# EasyEDA Pro project 包裹款-触摸屏控制板-V1.3(1).epro, board PCB2
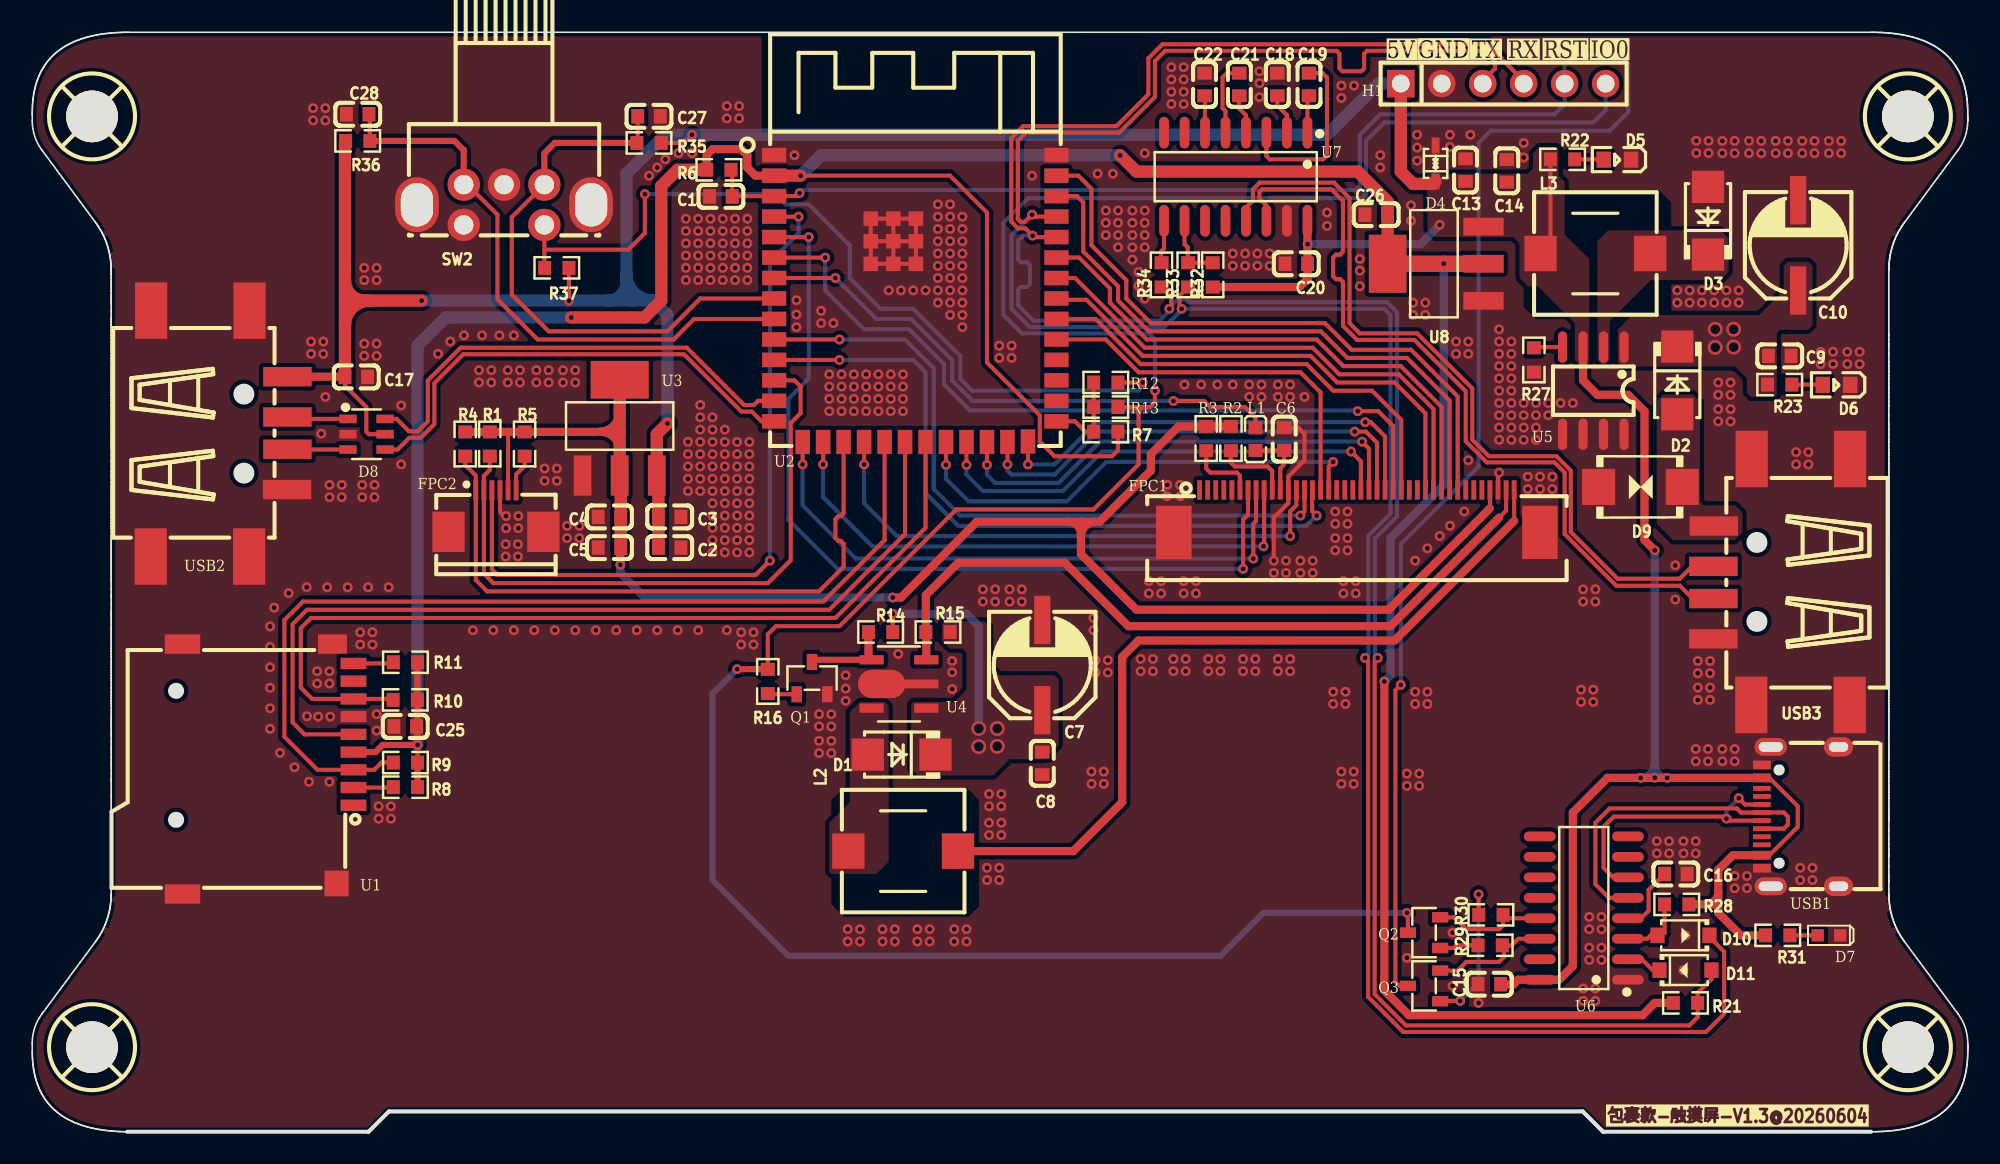
[diagram p1: board, top side]
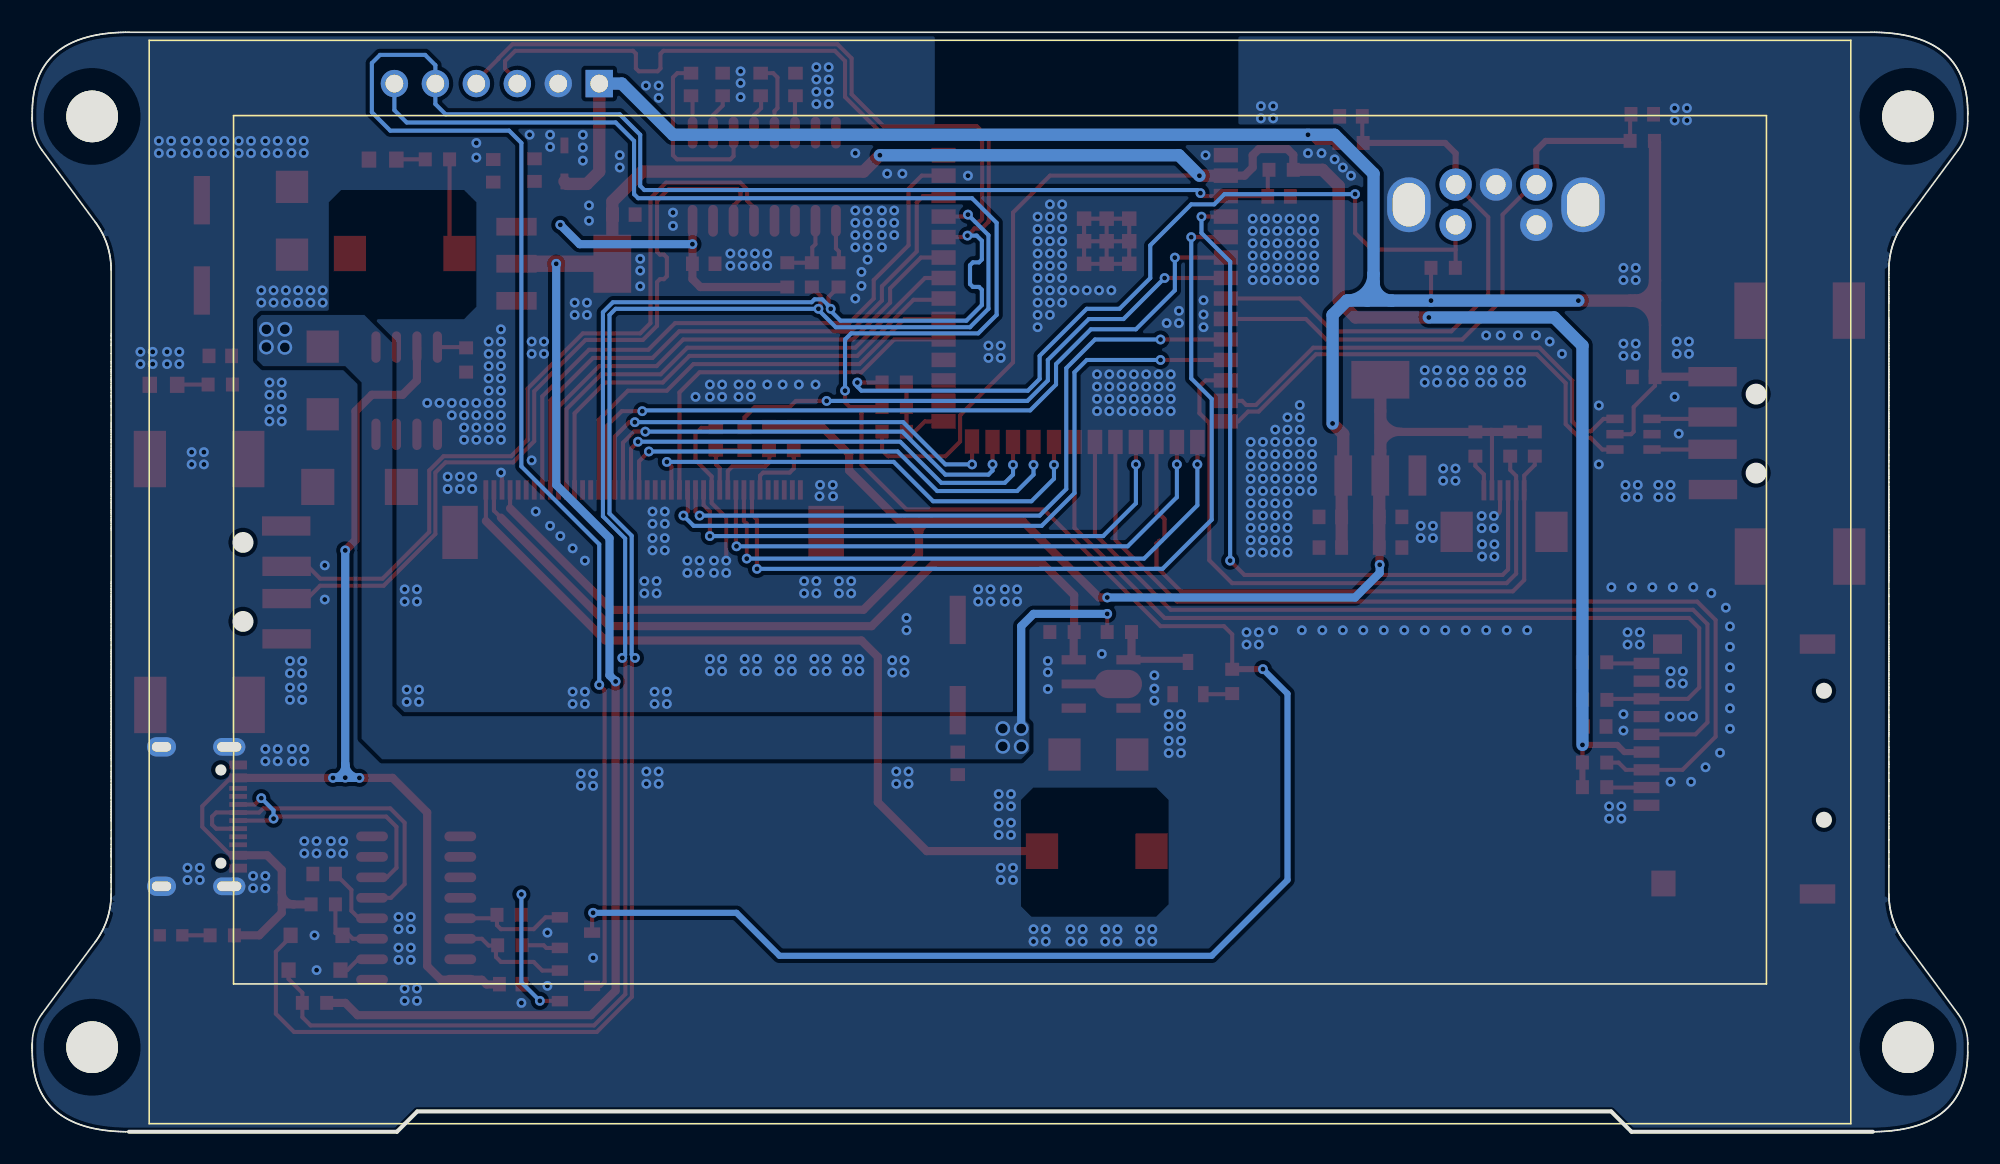
[diagram p2: board, bottom side, seen from below]

Outline 120 x 68.2 mm; copper layers: Top Layer, Bottom Layer. Coordinates in mm from the lower left corner of the outline.
Stack: Top Layer 0.035mm / Dielectric1 1.51mm FR4 er 4.5 / Bottom Layer 0.035mm

## Design rules (mm)
spacing copperThickness1oz (default): track to track 0.102, other pairs 0.152 to 0.3
spacing copperThickness2oz: track to track 0.203, other pairs 0.152 to 0.3
track width copperThickness1oz (default): min 0.127, default 0.254, max 2.54
track width copperThickness2oz: min 0.203, default 0.254, max 2.54
differential pair differentialPair (default): width min 0.127, default 0.254, max 2.54; gap min 0.152, default 0.152
net GND uses 无发散间距

## Placement (name value [footprint] x y rotation side)
C1  100nF  [C0603]  42.7 58.02 0 top
C2  1uF  [C0603]  39.52 36.23 180 top
C3  100nF  [C0603]  39.52 38.14 180 top
C4  1uF  [C0603]  35.79 38.14 0 top
C5  100nF  [C0603]  35.79 36.23 0 top
C6  100nF  [C0603]  77.62 42.96 270 top
C7  100uF  [电解电容贴片6X6]  62.62 28.95 90 top
C8  100nF  [C0603]  62.62 22.85 270 top
C9  100nF  [C0603]  108.34 48.12 180 top
C10  100uF  [电解电容贴片6X6]  109.49 54.98 90 top
C13  100nF  [C0603]  88.86 59.65 90 top
C14  10uF  [C0603]  91.42 59.6 270 top
C15  100nF  [C0603]  90.34 9.15 180 top
C16  100nF  [C0603]  101.9 15.99 0 top
C17  100nF  [C0603]  20.09 46.82 0 top
C18  100nF  [C0603]  77.19 64.96 270 top
C19  100nF  [C0603]  79.16 64.96 270 top
C20  100nF  [C0603]  78.37 53.84 0 top
C21  100nF  [C0603]  74.84 64.96 270 top
C22  100nF  [C0603]  72.68 64.96 90 top
C25  1uF  [C0603]  23.12 25.14 0 top
C26  100nF  [C0603]  83.32 56.89 0 top
C27  10nF  [C0603]  38.24 62.98 0 top
C28  10nF  [C0603]  20.18 63.11 180 top
D1  SS56  [SMA]  53.9 23.4 180 top
D2  SS56  [SMA]  101.99 46.6 270 top
D3  SS56  [SMA]  103.9 56.51 90 top
D4  PESD5V0L1BA-N  [SOD-323_L1.8-W1.3-LS2.5-BI]  87.01 60.06 270 top
D5  绿光  [0603LED]  98.31 60.32 0 top
D6  绿光  [0603LED]  111.9 46.35 0 top
D7  LED红  [0603L]  111.39 12.18 0 top
D8  USBLC6-2SC6  [SOT-23-6_L2.9-W1.6-P0.95-LS2.8-BL]  20.72 43.27 270 top
D9  SMBJ28CA  [SMB_L4.3-W3.6-LS5.4-BI]  99.71 40 180 top
D10  1N4148W  [SOD-123_L2.7-W1.6-LS3.7-FD]  102.37 12.18 0 top
D11  1N4148W  [SOD-123_L2.7-W1.6-LS3.7-FD]  102.5 10.03 180 top
FPC1  AFC07-S40ECA-00  [FPC-SMD_P0.50-40P_LCS-SJ-H2.0]  82.13 38.49 180 top
FPC2  FPC-05F-6PH20(0.5)  [FPC-SMD_6P-P0.50_XUNPU_FPC-05F-6PH20]  28.75 38.5 0 top
H1  PZ254V-11-06P  [HDR-TH_6P-P2.54-V-M]  91.2 65.02 0 top
L1  10uH  [L0603]  75.84 42.96 90 top
L2  68uH  [IND-SMD_L7.0-W7.0_SMDRI74-330MT]  54 17.41 0 top
L3  68uH  [IND-SMD_L7.0-W7.0_SMDRI74-330MT]  96.91 54.47 0 top
Q1  SS8050  [SOT-23-3_L2.9-W1.3-P1.90-LS2.4-BR]  48.35 28.14 270 top
Q2  SS8050  [SOT-23-3_L2.9-W1.3-P1.90-LS2.4-BR]  86.29 12.35 0 top
Q3  SS8050  [SOT-23-3_L2.9-W1.3-P1.90-LS2.4-BR]  86.29 9.05 0 top
R1  10kΩ  [R0603]  28.37 42.66 270 top
R2  10kΩ  [R0603]  74.32 43 270 top
R3  10kΩ  [R0603]  72.78 43 270 top
R4  10kΩ  [R0603]  26.84 42.66 270 top
R5  10kΩ  [R0603]  30.53 42.66 270 top
R6  10kΩ  [R0603]  42.57 59.67 0 top
R7  10kΩ  [R0603]  66.56 43.43 180 top
R8  10kΩ  [R0603]  23.14 21.37 0 top
R9  10kΩ  [R0603]  23.14 22.9 0 top
R10  10kΩ  [R0603]  23.12 26.79 0 top
R11  10kΩ  [R0603]  23.14 29.12 0 top
R12  0/NC  [R0603]  66.56 46.47 180 top
R13  0/NC  [R0603]  66.56 44.95 180 top
R14  51kΩ  [R0603]  52.6 31 180 top
R15  1kΩ  [R0603]  56.16 31 180 top
R16  1kΩ  [R0603]  45.6 27.93 90 top
R21  10kΩ  [R0603]  102.5 7.99 180 top
R22  10kΩ  [R0603]  94.88 60.32 180 top
R23  47kΩ  [R0603]  108.34 46.35 180 top
R27  10kΩ  [R0603]  93.1 47.87 270 top
R28  10kΩ  [R0603]  101.96 14.1 180 top
R29  10kΩ  [R0603]  90.39 11.57 0 top
R30  10kΩ  [R0603]  90.44 13.45 0 top
R31  10kΩ  [R0603]  108.22 12.18 0 top
R32  10kΩ  [R0603]  73.19 53.15 90 top
R33  100Ω  [R0603]  71.66 53.15 90 top
R34  100Ω  [R0603]  70.01 53.15 90 top
R35  10kΩ  [R0603]  38.24 61.33 180 top
R36  10kΩ  [R0603]  20.18 61.46 0 top
R37  10kΩ  [R0603]  32.52 53.59 180 top
SCREW1  -  [M3螺丝]  116.29 62.98 0 top
SCREW2  -  [M3螺丝]  3.71 62.98 0 top
SCREW3  -  [M3螺丝]  3.71 5.25 0 top
SCREW4  -  [M3螺丝]  116.29 5.25 0 top
SW2  EC11B15242AZ  [SW-TH_EC11B1524XX]  29.25 57.5 90 top
U1  自弹TF卡座TFAA  [SIM-SMD_C9900015645]  14.62 22.5 270 top
U2  ESPS3-32-WROOM-1-N16R8  [WIRELM-SMD_ESP32-S3-WROOM-2-N32R8V]  54.75 51.68 0 top
U3  AMS1117-3.3  [SOT-223-3_L6.5-W3.4-P2.30-LS7.0-BR]  36.42 43.67 270 top
U4  PT4115  [SOT-89-5_L4.5-W2.5-P1.50-LS4.5-BR]  53.73 27.78 0 top
U5  XL1509-5.0E1  [SOIC-8_L5.0-W4.0-P1.27-LS6.0-BL]  96.78 45.97 180 top
U6  CH340C  [SOIC-16_L9.9-W3.9-P1.27-LS6.0-BL]  96.2 13.88 90 top
U7  SP3232EEN-L/TR  [SOIC-16_L9.9-W3.9-P1.27-LS6.0-BL]  74.62 59.24 180 top
U8  AMS1117-3.3  [SOT-223-3_L6.5-W3.4-P2.30-LS7.0-BR]  87.01 53.84 0 top
USB1  TYPE-C 16PIN 2MD(073)  [USB-C-SMD_TYPE-C-16PIN-2MD-073]  109.61 19.55 90 top
USB2  AF 10.0 QT-ZB6.8  [USB-A-SMD_AF-10.0-QT-ZB6.8]  11.58 43.31 270 top
USB3  AF 10.0 QT-ZB6.8  [USB-A-SMD_AF-10.0-QT-ZB6.8]  108.47 34.1 90 top

## Footprints (pads in the part's own frame, mm; a bottom-side part is the same pattern mirrored in y, then rotated)
0603L
  rect 0.762x0.762 smd: 1(-0.699,0) 2(0.699,0)
0603LED
  rect 0.9x1 smd: 1(-0.884,-0.017) 2(0.816,-0.017)
C0603
  rect 0.8x0.9 smd: 1(-0.7,0) 2(0.7,0)
FPC-SMD_6P-P0.50_XUNPU_FPC-05F-6PH20
  rect 0.3x1.25 smd: 1(-1.25,1.288) 2(-0.75,1.288) 3(-0.25,1.288) 4(0.25,1.288) 5(0.75,1.288) 6(1.25,1.288)
  rect 2x2.5 smd: 7(2.94,-1.288) 8(-2.94,-1.288)
FPC-SMD_P0.50-40P_LCS-SJ-H2.0
  rect 0.3x1.2 smd: 1(9.751,-1.318) 2(9.252,-1.318) 3(8.753,-1.318) 4(8.252,-1.318) 5(7.752,-1.318) 6(7.252,-1.318) 7(6.752,-1.318) 8(6.251,-1.318) 9(5.753,-1.318) 10(5.253,-1.318) 11(4.753,-1.318) 12(4.252,-1.318) 13(3.752,-1.318) 14(3.251,-1.318) 15(2.752,-1.318) 16(2.253,-1.318) 17(1.752,-1.318) 18(1.252,-1.318) 19(0.752,-1.318) 20(0.252,-1.318) 21(-0.249,-1.318) 22(-0.748,-1.318) 23(-1.247,-1.318) 24(-1.748,-1.318) 25(-2.248,-1.318) 26(-2.748,-1.318) 27(-3.248,-1.318) 28(-3.749,-1.318) 29(-4.247,-1.318) 30(-4.747,-1.318) 31(-5.247,-1.318) 32(-5.748,-1.318) 33(-6.248,-1.318) 34(-6.749,-1.318) 35(-7.248,-1.318) 36(-7.747,-1.318) 37(-8.248,-1.318) 38(-8.748,-1.318) 39(-9.248,-1.318) 40(-9.748,-1.318)
  rect 2.2x3.3 smd: 41(11.35,1.318) 42(-11.35,1.318)
HDR-TH_6P-P2.54-V-M
  rect 1.7x1.7 hole 1.1: 1(-6.35,0)
  round 1.7 hole 1.1: 2(-3.81,0) 3(-1.27,0) 4(1.27,0) 5(3.81,0) 6(6.35,0)
IND-SMD_L7.0-W7.0_SMDRI74-330MT
  rect 2x2.2 smd: 1(-3.4,0) 2(3.4,0)
L0603
  rect 0.8x0.864 smd: 1(-0.7,0) 2(0.7,0)
M3螺丝
  round 3.2 hole 3.2: 1(0,0)
R0603
  rect 0.806x0.864 smd: 1(-0.753,0) 2(0.753,0)
SIM-SMD_C9900015645
  rect 0.7x1.6 smd: 1(2.25,5.3) 2(1.15,5.3) 3(0.05,5.3) 4(-1.05,5.3) 5(-2.15,5.3) 6(-3.25,5.3) 7(-4.35,5.3) 8(-5.45,5.3) 9(-6.55,5.3)
  rect 1.2x1.8 smd: 10(-7.75,4)
  rect 1.6x1.5 smd: 11(7.1,4.25)
  rect 1.2x2.2 smd: 12(-7.75,-5.3) 13(7.75,-5.3)
SMA
  rect 2x2 smd: 1(2.1,0) 2(-2.1,0)
SMB_L4.3-W3.6-LS5.4-BI
  rect 2.047x2.241 smd: 1(-2.591,0) 2(2.591,0)
SOD-123_L2.7-W1.6-LS3.7-FD
  rect 0.88x0.96 smd: 1(-1.61,0) 2(1.61,0)
SOD-323_L1.8-W1.3-LS2.5-BI
  rect 0.985x0.49 smd: 1(-1.117,0) 2(1.117,0)
SOIC-8_L5.0-W4.0-P1.27-LS6.0-BL
  oval 0.569x1.95 smd: 1(-1.905,-2.705) 2(-0.635,-2.705) 3(0.635,-2.705) 4(1.905,-2.705) 5(1.905,2.705) 6(0.635,2.705) 7(-0.635,2.705) 8(-1.905,2.705)
SOIC-16_L9.9-W3.9-P1.27-LS6.0-BL
  oval 0.602x1.971 smd: 1(-4.445,-2.736) 2(-3.175,-2.736) 3(-1.905,-2.736) 4(-0.635,-2.736) 5(0.635,-2.736) 6(1.905,-2.736) 7(3.175,-2.736) 8(4.445,-2.736) 9(4.445,2.736) 10(3.175,2.736) 11(1.905,2.736) 12(0.635,2.736) 13(-0.635,2.736) 14(-1.905,2.736) 15(-3.175,2.736) 16(-4.445,2.736)
SOT-23-3_L2.9-W1.3-P1.90-LS2.4-BR
  rect 1x0.65 smd: 1(1,-0.95) 2(1,0.95) 3(-1,0)
SOT-23-6_L2.9-W1.6-P0.95-LS2.8-BL
  rect 0.532x1.072 smd: 1(-0.95,-1.149) 2(0,-1.149) 3(0.95,-1.149) 4(0.95,1.149) 5(0,1.149) 6(-0.95,1.149)
SOT-89-5_L4.5-W2.5-P1.50-LS4.5-BR
  rect 1.5x0.574 smd: 1(1.698,-1.5) 3(1.698,1.5) 4(-1.698,1.5) 5(-1.698,-1.5)
  oval 2.94x1.76 smd: 2(-1.067,0)
  rect 2.209x0.552 smd: 2(1.343,0)
SOT-223-3_L6.5-W3.4-P2.30-LS7.0-BR
  rect 2.5x1.1 smd: 1(2.97,-2.3) 2(2.97,0) 3(2.97,2.3)
  rect 2.34x3.6 smd: 4(-2.97,0)
SW-TH_EC11B1524XX
  round 2 hole 1.2: A(1.25,-2.5) B(1.25,2.5) C(1.25,-0.001) D(-1.25,-2.5) E(-1.25,2.5)
  oval 3.4x2.7 hole 2.7x2: EH(0,5.4) EH(0,-5.4)
USB-A-SMD_AF-10.0-QT-ZB6.8
  rect 1.2x3 smd: 1(-3.528,4.237) 2(-1.028,4.237) 3(0.972,4.237) 4(3.472,4.213)
  rect 3.5x2 smd: 5(-7.628,-4.213) 5(-7.622,1.887) 5(7.628,1.863) 5(7.628,-4.237)
USB-C-SMD_TYPE-C-16PIN-2MD-073
  oval 1.1x2 hole 0.6x1.5: 13(-4.325,1.825) 14(4.325,1.825)
  oval 1.2x1.8 hole 0.6x1.2: 13(-4.325,-2.375) 14(4.325,-2.375)
  rect 0.55x1.1 smd: A1B12(-3.2,2.375) A4B9(-2.4,2.375) B1A12(3.2,2.375) B4A9(2.4,2.375)
  rect 0.3x1.1 smd: A5(-1.25,2.375) A6(-0.25,2.375) A7(0.25,2.375) A8(1.25,2.375) B5(1.75,2.375) B6(0.75,2.375) B7(-0.75,2.375) B8(-1.75,2.375)
WIRELM-SMD_ESP32-S3-WROOM-2-N32R8V
  rect 1.5x0.9 smd: 1(-8.75,8.895) 2(-8.75,7.625) 3(-8.75,6.355) 4(-8.75,5.085) 5(-8.75,3.815) 6(-8.75,2.545) 7(-8.75,1.275) 8(-8.75,0.005) 9(-8.75,-1.265) 10(-8.75,-2.535) 11(-8.75,-3.805) 12(-8.75,-5.075) 13(-8.75,-6.345) 14(-8.75,-7.615) 27(8.75,-7.615) 28(8.75,-6.345) 29(8.75,-5.075) 30(8.75,-3.805) 31(8.75,-2.535) 32(8.75,-1.265) 33(8.75,0.005) 34(8.75,1.275) 35(8.75,2.545) 36(8.75,3.815) 37(8.75,5.085) 38(8.75,6.355) 39(8.75,7.625) 40(8.75,8.895)
  rect 0.9x1.5 smd: 15(-6.985,-8.895) 16(-5.715,-8.895) 17(-4.445,-8.895) 18(-3.175,-8.895) 19(-1.905,-8.895) 20(-0.635,-8.895) 21(0.635,-8.895) 22(1.905,-8.895) 23(3.175,-8.895) 24(4.445,-8.895) 25(5.715,-8.895) 26(6.985,-8.865)
  rect 0.9x0.9 smd: 41(-2.76,4.955) 41(-2.76,3.554) 41(-2.76,2.155) 41(-1.36,4.955) 41(-1.36,3.554) 41(-1.36,2.155) 41(0.04,4.955) 41(0.04,3.554) 41(0.04,2.155)
电解电容贴片6X6
  rect 3x1 smd: 1(-2.8,0) 2(2.8,0)

## Nets
As in the schematic.

Pads without a net: FPC1 1 2 3 4 18 19 20 27 28 34 35 36; SCREW1 1; SCREW2 1; SCREW3 1; SCREW4 1; U1 1 8; U2 28 29 30; U6 7 8 9 10 11 12 15; U7 7 8 11 12; USB1 A5 A8 B5 B8

## Via types
v1: diameter 0.61, hole 0.305, Top Layer to Bottom Layer, 726 vias
v2: diameter 0.914, hole 0.61, Top Layer to Bottom Layer, 8 vias

## Routing (per net, layer and track width the routed paths; a pad name or vN(x,y) marks a point on that pad's centre or on a via; arc(x,y) is an arc through that point)
3V3: length 219.3
  Top Layer w0.254: R7.1 67.31,42.27 66.94,41.9 63.38,41.9 62.47,42.82 62.47,44.44 59.19,47.72 59.19,57.02 56.9,59.31 47.64,59.31 ; R9.2 23.89,22.9 v1(23.89,24)
  Top Layer w0.381: U1.4 21.28,23.55 21.73,24 v1(23.89,24) 23.89,26.78 R10.2 23.88,29.11 R11.2 ; R9.2 R8.2
  Top Layer w0.508: U2.2 44.84,59.31 44.33,59.81 44.33,60.57 43.95,60.95 42.18,60.95 41.82,60.59 R6.1 ; R21.2 100.59,7.99 99.83,7.23 85.35,7.23 83.83,8.75 v1(83.83,27.93)
  Top Layer w0.762: v1(67.45,60.57) 68.46,59.56 82.18,59.56 84.04,57.7 U8.4 ; v1(33.41,50.51) 37.95,50.51 39,51.55 39,58.67 40,59.67 R6.1 ; v1(47.64,59.3) 46,59.3 U2.2
  Top Layer w1.016: U8.4 v1(87.51,53.84) U8.2
  Bottom Layer w0.508: v1(83.83,27.93) 84.21,28.31 84.21,36.82 87.51,40.12 v1(87.51,53.84)
  Bottom Layer w0.762: v1(47.64,59.3) 48.91,60.57 v1(67.45,60.57) ; v1(33.41,50.51) 25.63,50.51 23.89,48.76 v1(23.89,24)
3V3_CM: length 107.8
  Top Layer w0.254: 29.5,39.79 29.5,43.36 29.55,43.41 ; FPC1.37 90.38,38.67
  Top Layer w0.508: 65.93,37.84 66.18,37.84 69.35,41.01 69.35,42.03 71.08,43.75 R3.1 R2.1 ; 65.93,37.84 65.02,37.84 ; 65.93,37.84 arc(65.29,37.57) 65.02,36.93 ; 65.02,37.84 65.02,37.06 ; 65.02,37.84 64.24,37.84 ; 65.02,37.06 65.02,36.93 ; 65.02,37.06 arc(64.79,37.61) 64.24,37.84 ; v1(53.35,33.14) 53.86,33.14 58.56,37.84 64.24,37.84 ; 36.42,43.42 36.41,43.41 35.24,43.41 ; 35.13,43.41 R5.1 R1.1 R4.1 ; 35.13,43.41 35.24,43.41 ; 35.13,43.41 arc(36.04,43.79) 36.42,44.7 ; C5.2 36.46,36.21 v1(36.46,35.17) ; 65.02,36.93 65.02,35.82 68.46,32.38 84.09,32.38 90.38,38.67 ; 35.24,43.41 arc(36.07,43.07) 36.42,42.23
  Top Layer w0.762: C5.2 C4.2 36.49,40.64 U3.2 U3.4
  Bottom Layer w0.508: v1(53.35,33.14) 37.98,33.14 36.46,34.66 v1(36.46,35.17)
5V_SHAOLU: length 242.7
  Top Layer w0.254: C17.1 19.39,46.27 20.71,44.95 20.71,43.43 20.87,43.27 D8.5 ; R37.1 v1(33.28,51.55) ; R35.1 40.4,61.33 v1(40.91,61.84) ; R22.2 94.13,55.09 L3.1 ; USB1.A4B9 107.7,17.15 109.46,18.91 109.46,20.19 107.7,21.95 USB1.B4A9
  Top Layer w0.508: C15.1 91.05,9.14 91.83,9.14 92.13,9.43 U6.16 94.67,9.43 95.51,10.28 95.51,19.8 97.66,21.95 v1(99.72,21.95) v1(101.36,21.95) USB1.B4A9 ; 104.53,14.85 104.53,16.25 105.43,17.15 USB1.A4B9 ; 104.53,14.85 104.53,14.1 ; 104.53,14.85 arc(104.31,14.32) 103.78,14.1 ; 15.82,46.83 19.38,46.83 C17.1 ; 103.78,14.1 R28.1 ; 103.78,14.1 104.53,14.1 ; 104.53,14.1 104.53,13.58 105.93,12.18 R31.1 ; v1(100.59,36.06) 99.96,36.69 99.96,44.7 98.94,45.71 97.04,45.71 96.15,46.6 96.15,48.67 ; U7.16 79.06,53.85 C20.2 79.07,52.89 78.58,52.4 R32.1
  Top Layer w0.762: H1.1 84.85,59.56 85.61,58.79 86.85,58.79 D4.2 ; 19.39,51.55 19.39,50.02 ; 19.39,51.55 20.64,51.55 ; 19.39,51.55 19.39,52.8 ; 19.39,50.02 C17.1 ; 19.39,50.02 arc(19.84,51.1) 20.92,51.55 ; 20.64,51.55 20.92,51.55 ; 20.64,51.55 arc(19.76,51.92) 19.39,52.8 ; C2.2 C3.2 38.82,40.6 U3.3 38.72,43.27 v1(39.38,43.93) ; 19.39,52.8 19.39,61.4 19.45,61.46 ; v1(24.14,51.55) 20.92,51.55
  Bottom Layer w0.508: v1(79.07,55.06) 86.06,55.06 v1(87.26,56.25) ; v1(100.59,36.06) 100.59,22.83 ; 100.59,22.83 100.59,22.71 ; 100.59,22.83 arc(100.34,22.21) v1(99.72,21.95) v1(101.36,21.95) arc(100.82,22.17) 100.59,22.71 ; 100.59,22.71 v1(100.59,21.96)
  Bottom Layer w0.762: 36.84,53.2 36.84,59.43 39.25,61.84 v1(40.91,61.84) 80.28,61.84 83.45,65.02 H1.1 ; 36.84,53.2 36.84,52.7 ; 36.84,53.2 arc(37.32,52.04) 38.49,51.55 ; 37.22,51.55 38.49,51.55 ; 37.22,51.55 35.7,51.55 ; 37.22,51.55 36.84,51.94 36.84,52.7 ; 38.49,51.55 39.38,50.67 v1(39.38,43.93) ; 36.84,52.7 arc(36.51,51.89) 35.7,51.55 ; 35.7,51.55 v1(33.28,51.55) v1(24.14,51.55)
24V_D1: length 13.1
  Top Layer w0.254: 53.35,31 v1(53.35,32.12)
  Bottom Layer w0.508: v1(53.35,32.12) 57.92,32.12 58.69,31.36 v2(58.69,25.01)
  vias: v2(58.69,23.89) v2(59.83,25.01) v2(59.83,23.91) v2(104.34,49.78) v2(104.34,48.65) v2(105.48,49.78) v2(105.48,48.67)
GND: length 29.8
  Top Layer w0.254: U2.41 U2.41 U2.41 ; U2.41 U2.41 ; U2.41 U2.41 U2.41 ; FPC1.38 90.88,40.82 v1(90.94,40.89) ; 29,39.79 29,38.58 arc(29.11,38.31) v1(29.38,38.2) ; U2.41 U2.41 U2.41 ; U2.41 U2.41 ; U2.41 U2.41 ; U2.41 U2.41 ; U2.41 U2.41 U2.41 ; v1(76.97,35.42) 76.97,38.09 77.88,39 FPC1.12 77.88,40.65 78.88,41.65 78.88,43.3 78.51,43.66 C6.1
  vias: v1(14.74,31.34) v1(14.74,30.07) v1(14.74,28.8) v1(14.74,27.53) v1(14.74,26.26) v1(14.74,24.99) v1(15,32.51) v1(15.36,23.5) v1(15.9,33.41) v1(16.26,22.61) v1(17.02,33.77) v1(17.03,25.77) v1(17.16,21.71) v1(17.28,49.01) v1(17.28,48.25) v1(17.41,63.49) v1(17.41,62.73) v1(17.66,28.57) v1(17.66,27.81) v1(17.73,25.75) v1(17.92,43.3) v1(18.05,49.01) v1(18.05,48.25) v1(18.17,63.49) v1(18.17,62.73) v1(18.17,45.58) v1(18.29,33.77) v1(18.43,40.12) v1(18.43,39.36) v1(18.43,28.57) v1(18.43,27.81) v1(18.48,25.75) v1(18.43,21.71) v1(19.19,40.12) v1(19.19,39.36) v1(19.56,33.77) v1(20.33,30.98) v1(20.33,30.22) v1(20.46,40.12) v1(20.46,39.36) v1(20.58,53.59) v1(20.58,52.82) v1(20.58,48.89) v1(20.58,48.12) v1(20.83,33.77) v1(21.09,30.98) v1(21.09,30.22) v1(21.22,40.12) v1(21.22,39.36) v1(21.35,53.59) v1(21.35,52.82) v1(21.35,48.89) v1(21.35,48.12) v1(21.35,25.9) v1(21.35,24.88) v1(21.47,20.19) v1(21.47,19.42) v1(22.1,33.77) v1(22.24,20.19) v1(22.24,19.42) v1(22.87,45.05) v1(22.87,41.39) v1(25.16,48.25) v1(25.92,49.01) v1(26.77,49.39) v1(27.32,31.11) v1(27.7,47.24) v1(27.7,46.47) v1(27.89,49.39) v1(28.46,47.24) v1(28.46,46.47) v1(28.59,31.11) v1(28.96,49.39) v1(29.38,37.44) v1(29.35,36.44) v1(29.35,35.68) v1(29.47,47.24) v1(29.47,46.47) v1(29.86,49.39) v1(29.86,31.11) v1(30.14,38.2) v1(30.14,37.44) v1(30.11,36.44) v1(30.11,35.68) v1(30.24,47.24) v1(30.24,46.47) v1(31.13,31.11) v1(31.25,47.24) v1(31.25,46.47) v1(31.76,41.14) v1(31.76,40.38) v1(32.02,47.24) v1(32.02,46.47) v1(32.4,31.11) v1(32.52,41.14) v1(32.52,40.38) v1(32.9,47.24) v1(32.9,46.47) v1(33.16,37.58) v1(33.16,36.82) v1(33.67,47.24) v1(33.67,46.47) v1(33.67,31.11) v1(33.92,37.58) v1(33.92,36.82) v1(34.94,31.11) v1(36.21,31.11) v1(37.48,31.11) v1(38.24,59.3) v1(38.75,59.81) v1(38.75,31.11) v1(39.25,60.32) v1(40.07,60.7) v1(40.02,31.11) v1(40.52,56.63) v1(40.52,55.87) v1(40.52,55.11) v1(40.52,54.35) v1(40.52,53.59) v1(40.52,52.82) v1(40.65,42.79) v1(40.65,42.03) v1(40.65,41.27) v1(40.65,40.5) v1(40.65,39.74) v1(40.91,60.7) v1(41.29,56.63) v1(41.29,55.87) v1(41.29,55.11) v1(41.29,54.35) v1(41.29,53.59) v1(41.29,52.82) v1(41.29,31.11) v1(41.41,45.08) v1(41.41,44.31) v1(41.41,43.55) v1(41.41,42.79) v1(41.41,42.03) v1(41.41,41.27) v1(41.41,40.5) v1(41.41,39.74) v1(42.05,56.63) v1(42.05,55.87) v1(42.05,55.11) v1(42.05,54.35) v1(42.05,53.59) v1(42.05,52.82) v1(42.18,44.31) v1(42.18,43.55) v1(42.18,42.79) v1(42.18,42.03) v1(42.18,41.27) v1(42.18,40.5) v1(42.18,39.74) v1(42.18,38.98) v1(42.18,38.22) v1(42.18,37.46) v1(42.18,36.69) v1(42.18,35.93) v1(42.81,56.63) v1(42.81,55.87) v1(42.81,55.11) v1(42.81,54.35) v1(42.81,53.59) v1(42.81,52.82) v1(42.94,43.55) v1(42.94,42.79) v1(42.94,42.03) v1(42.94,41.27) v1(42.94,40.5) v1(42.94,39.74) v1(42.94,38.98) v1(42.94,38.22) v1(42.94,37.46) v1(42.94,36.69) v1(42.94,35.93) v1(43.06,63.62) v1(43.06,62.86) v1(43.06,31.11) v1(43.57,56.63) v1(43.57,55.87) v1(43.57,55.11) v1(43.57,54.35) v1(43.57,53.59) v1(43.57,52.82) v1(43.7,42.79) v1(43.7,42.03) v1(43.7,41.27) v1(43.7,40.5) v1(43.7,39.74) v1(43.7,38.98) v1(43.7,38.22) v1(43.7,37.46) v1(43.7,36.69) v1(43.7,35.93) v1(43.83,63.62) v1(43.83,62.86) v1(43.95,30.98) v1(43.95,30.22) v1(44.33,56.63) v1(44.33,55.87) v1(44.33,55.11) v1(44.33,54.35) v1(44.33,53.59) v1(44.33,52.82) v1(44.46,42.79) v1(44.46,42.03) v1(44.46,41.27) v1(44.46,40.5) v1(44.46,39.74) v1(44.46,38.98) v1(44.46,38.22) v1(44.46,37.46) v1(44.46,36.69) v1(44.46,35.93) v1(44.72,30.98) v1(44.72,30.22) v1(47.25,60.57) v1(47.38,51.58) v1(47.38,50.69) v1(47.38,49.9) v1(48.78,25.9) v1(48.78,25.14) v1(48.78,24.25) v1(48.78,23.49) v1(48.91,50.92) v1(48.91,50.16) v1(49.41,46.98) v1(49.41,46.22) v1(49.41,45.46) v1(49.41,44.7) v1(49.54,25.9) v1(49.54,25.14) v1(49.54,24.25) v1(49.54,23.49) v1(49.67,50.16) v1(50.18,46.98) v1(50.18,46.22) v1(50.18,45.46) v1(50.18,44.7) v1(50.43,28.31) v1(50.43,27.49) v1(50.43,26.74) v1(50.56,12.56) v1(50.56,11.8) v1(50.94,46.98) v1(50.94,46.22) v1(50.94,45.46) v1(50.94,44.7) v1(51.32,12.56) v1(51.32,11.8) v1(51.7,46.98) v1(51.7,46.22) v1(51.7,45.46) v1(51.7,44.7) v1(52.46,46.98) v1(52.46,46.22) v1(52.46,45.46) v1(52.46,44.7) v1(52.72,12.56) v1(52.72,11.8) v1(53.1,52.19) v1(53.22,46.98) v1(53.22,46.22) v1(53.22,45.46) v1(53.22,44.7) v1(53.48,12.56) v1(53.48,11.8) v1(53.69,29.64) v1(53.86,52.19) v1(53.99,46.98) v1(53.99,46.22) v1(53.99,45.46) v1(53.99,44.7) v1(54.62,52.19) v1(54.88,12.56) v1(54.88,11.8) v1(55.38,52.19) v1(55.64,12.56) v1(55.64,11.8) v1(56.15,57.52) v1(56.15,56.76) v1(56.15,56) v1(56.15,55.24) v1(56.15,54.47) v1(56.15,53.71) v1(56.15,52.95) v1(56.15,52.19) v1(56.15,51.43) v1(56.91,57.52) v1(56.91,56.76) v1(56.91,56) v1(56.91,55.24) v1(56.91,54.47) v1(56.91,53.71) v1(56.91,52.95) v1(56.91,52.19) v1(56.91,51.43) v1(56.91,50.67) v1(57.03,29.2) v1(57.03,28.5) v1(57.03,27.46) v1(57.16,12.56) v1(57.16,11.8) v1(57.67,56.76) v1(57.67,56) v1(57.67,55.24) v1(57.67,54.47) v1(57.67,53.71) v1(57.67,52.95) v1(57.67,52.19) v1(57.67,51.43) v1(57.67,50.67) v1(57.67,49.9) v1(57.92,12.56) v1(57.92,11.8) v1(58.94,33.65) v1(58.94,32.89) v1(59.19,16.38) v1(59.19,15.61) v1(59.32,20.95) v1(59.32,20.19) v1(59.32,19.17) v1(59.32,18.41) v1(59.7,33.65) v1(59.7,32.89) v1(59.96,48.76) v1(59.96,48) v1(59.96,16.38) v1(59.96,15.61) v1(60.08,20.95) v1(60.08,20.19) v1(60.08,19.17) v1(60.08,18.41) v1(60.59,33.65) v1(60.59,32.89) v1(60.72,48.76) v1(60.72,48) v1(61.35,33.65) v1(61.35,32.89) v1(61.99,59.3) v1(65.67,22.34) v1(65.67,21.58) v1(65.8,31.87) v1(65.8,31.11) v1(65.92,29.24) v1(65.92,28.48) v1(66.05,59.43) v1(66.43,22.34) v1(66.43,21.58) v1(66.56,57.14) v1(66.56,56.38) v1(66.56,55.62) v1(66.68,29.24) v1(66.68,28.48) v1(67,59.43) v1(67.32,57.14) v1(67.32,56.38) v1(67.32,55.62) v1(67.32,54.86) v1(68.21,57.14) v1(68.21,56.38) v1(68.21,55.62) v1(68.21,54.86) v1(68.21,54.09) v1(68.59,53.33) v1(68.59,52.47) v1(68.72,29.33) v1(68.72,28.57) v1(68.97,60.7) v1(68.97,57.14) v1(68.97,56.38) v1(68.97,55.62) v1(68.97,54.86) v1(68.97,51.68) v1(69.23,34.16) v1(69.23,33.39) v1(69.48,29.33) v1(69.48,28.57) v1(69.99,34.16) v1(69.99,33.39) v1(70.37,40.12) v1(70.35,39.42) v1(70.62,66.03) v1(70.62,65.27) v1(70.62,64.51) v1(70.62,63.75) v1(70.75,29.33) v1(70.75,28.57) v1(71.16,40.12) v1(71.19,39.42) v1(71.38,66.03) v1(71.38,65.27) v1(71.38,64.51) v1(71.38,63.75) v1(71.38,34.16) v1(71.38,33.39) v1(71.44,46.35) v1(71.51,29.33) v1(71.51,28.57) v1(72.15,34.16) v1(72.15,33.39) v1(72.47,46.35) v1(72.91,29.33) v1(72.91,28.57) v1(73.48,46.35) v1(73.67,29.33) v1(73.67,28.57) v1(74.43,54.47) v1(74.43,53.71) v1(74.43,46.35) v1(75.07,29.33) v1(75.07,28.57) v1(75.19,54.47) v1(75.19,53.71) v1(75.45,46.35) v1(75.45,45.58) v1(75.83,29.33) v1(75.83,28.57) v1(75.96,54.47) v1(75.96,53.71) v1(76.08,65.78) v1(76.08,65.05) v1(76.08,64.18) v1(76.21,46.35) v1(76.21,45.58) v1(76.72,54.47) v1(76.72,53.71) v1(76.97,34.66) v1(77.23,46.35) v1(77.23,45.58) v1(77.23,29.33) v1(77.23,28.57) v1(77.74,35.42) v1(77.74,34.66) v1(77.99,46.35) v1(77.99,45.58) v1(77.99,29.33) v1(77.99,28.57) v1(78.62,35.42) v1(78.62,34.66) v1(78.88,45.58) v1(79.39,35.42) v1(79.39,34.66) v1(80.28,57.02) v1(80.28,56.19) v1(80.66,27.3) v1(80.66,26.53) v1(80.78,38.47) v1(80.78,37.71) v1(80.78,36.82) v1(80.78,36.06) v1(81.16,64.89) v1(81.16,64.13) v1(81.16,22.34) v1(81.16,21.58) v1(81.29,34.16) v1(81.29,33.39) v1(81.42,27.3) v1(81.42,26.53) v1(81.54,38.47) v1(81.54,37.71) v1(81.54,36.82) v1(81.54,36.06) v1(81.95,64.89) v1(81.93,22.34) v1(81.93,21.58) v1(82.05,34.16) v1(82.05,33.39) v1(82.31,54.14) v1(82.31,53.41) v1(82.31,52.44) v1(83.58,60.57) v1(83.58,59.81) v1(85.23,22.22) v1(85.23,21.45) v1(85.23,10.79) v1(85.48,57.46) v1(85.48,56.51) v1(85.61,51.43) v1(85.61,50.67) v1(85.74,35.42) v1(85.74,27.3) v1(85.74,26.53) v1(85.86,61.84) v1(85.86,61.05) v1(85.86,60.24) v1(85.99,22.22) v1(85.99,21.45) v1(86.37,51.43) v1(86.37,50.67) v1(86.5,36.19) v1(86.5,27.3) v1(86.5,26.53) v1(87.26,36.95) v1(87.9,61.84) v1(87.9,61.09) v1(87.9,37.58) v1(88.06,12.35) v1(88.06,9.05) v1(88.28,49.01) v1(88.28,48.25) v1(88.78,38.47) v1(89.04,49.01) v1(89.04,48.25) v1(89.04,41.65) v1(89.16,61.84) v1(89.67,7.99) v1(90.94,49.78) v1(90.94,49.01) v1(90.94,48.25) v1(90.94,47.49) v1(90.94,46.73) v1(90.94,45.97) v1(90.94,45.2) v1(90.94,44.44) v1(90.94,43.68) v1(90.94,42.92) v1(91.71,49.01) v1(91.71,48.25) v1(91.71,47.49) v1(91.71,46.73) v1(91.71,45.97) v1(91.71,45.2) v1(91.71,44.44) v1(91.71,43.68) v1(91.71,42.92) v1(92.47,61.33) v1(92.47,60.43) v1(92.47,45.2) v1(92.47,44.44) v1(92.47,43.68) v1(92.47,42.92) v1(92.72,40.63) v1(92.72,39.87) v1(93.23,45.2) v1(93.23,44.44) v1(93.23,43.68) v1(93.23,42.92) v1(93.48,40.63) v1(93.48,39.87) v1(93.99,45.2) v1(93.99,44.44) v1(94.25,40.63) v1(94.25,39.87) v1(94.75,45.2) v1(95.51,45.2) v1(96.02,27.42) v1(96.02,26.66) v1(96.15,33.65) v1(96.15,32.89) v1(96.15,8.88) v1(96.15,8.12) v1(96.53,13.33) v1(96.53,12.56) v1(96.53,11.42) v1(96.53,10.66) v1(96.78,27.42) v1(96.78,26.66) v1(96.91,33.65) v1(96.91,32.89) v1(96.91,8.88) v1(96.91,8.12) v1(97.29,13.33) v1(97.29,12.56) v1(97.29,11.42) v1(97.29,10.66) v1(100.72,18.03) v1(100.72,17.26) v1(101.48,18.03) v1(101.48,17.26) v1(101.87,35.13) v1(101.87,33.01) v1(101.99,52.19) v1(101.99,51.43) v1(102.37,18.03) v1(102.37,17.26) v1(102.37,10.03) v1(102.5,12.18) v1(102.75,52.19) v1(102.75,51.43) v1(103.17,61.47) v1(103.17,60.71) v1(103.13,23.74) v1(103.13,22.98) v1(103.13,18.03) v1(103.13,17.26) v1(103.26,29.2) v1(103.26,28.44) v1(103.26,27.55) v1(103.26,26.79) v1(103.52,52.19) v1(103.52,51.43) v1(103.9,23.74) v1(103.9,22.98) v1(103.93,61.47) v1(103.93,60.71) v1(104.02,29.2) v1(104.02,28.44) v1(104.02,27.55) v1(104.02,26.79) v1(104.28,52.19) v1(104.28,51.43) v1(104.53,46.47) v1(104.53,45.71) v1(104.53,44.82) v1(104.53,44.06) v1(104.79,61.46) v1(104.79,60.7) v1(104.79,23.74) v1(104.79,22.98) v1(105.04,52.19) v1(105.04,51.43) v1(105.29,46.47) v1(105.29,45.71) v1(105.29,44.82) v1(105.29,44.06) v1(105.55,61.46) v1(105.55,60.7) v1(105.55,23.74) v1(105.55,22.98) v1(105.55,15.87) v1(105.55,15.11) v1(105.8,52.19) v1(105.8,51.43) v1(106.31,15.87) v1(106.31,15.11) v1(106.44,61.46) v1(106.44,60.7) v1(107.2,61.46) v1(107.2,60.7) v1(108.09,61.46) v1(108.09,60.7) v1(108.85,61.46) v1(108.85,60.7) v1(109.36,42.16) v1(109.36,41.39) v1(109.61,16.38) v1(109.61,15.61) v1(109.74,61.46) v1(109.74,60.7) v1(110.12,42.16) v1(110.12,41.39) v1(110.37,16.38) v1(110.37,15.61) v1(110.5,61.46) v1(110.5,60.7) v1(110.88,48.38) v1(110.88,47.62) v1(111.39,61.46) v1(111.39,60.7) v1(111.64,48.38) v1(111.64,47.62) v1(112.15,61.46) v1(112.15,60.7) v1(112.53,48.38) v1(112.53,47.62) v1(113.29,48.38) v1(113.29,47.62)
CPT_RST: length 2.3
  Top Layer w0.254: 30,39.79 30,40.78 30.53,41.3 R5.2
D1+: length 3.8
  Top Layer w0.254: 15.82,42.33 15.84,42.32 D8.3
D1-: length 3.8
  Top Layer w0.254: D8.1 15.94,44.22 15.82,44.33
DISP: length 4.7
  Top Layer w0.254: FPC1.10 76.88,40.98 76.59,41.27 74.56,41.27 74.31,41.52 74.31,42.23 R2.2
DTR: length 7.3
  Top Layer w0.254: U6.13 91.4,13.24 R30.2 91.19,12.81 90.94,12.56 88.91,12.56 88.18,13.3 Q2.2
ESP_RST: length 132.5
  Top Layer w0.254: v1(84.85,27.72) 84.51,27.38 84.51,9.3 84.77,9.05 Q3.3 ; R6.2 43.4,59.59 C1.2 43.41,58.04 U2.3 47.39,58.04 v1(47.57,58.22)
  Bottom Layer w0.254: v1(47.57,58.22) 47.76,58.41 82.05,58.41 82.31,58.67 82.31,61.84 83.58,63.11 94.37,63.11 95.01,63.75 H1.5 95.01,66.16 95.64,66.79 98.44,66.79 98.94,66.29 98.94,63.24 97.8,62.09 90.44,62.09 89.67,61.33 89.67,41.27 84.85,36.44 v1(84.85,27.72)
IO0_G3: length 163.2
  Top Layer w0.254: Q2.3 85.29,13.52 v1(85.23,13.58) ; 69,44.95 69.31,44.95 69.61,45.25 v1(69.61,45.97) ; 69,44.95 68.59,44.95 ; 69,44.95 arc(68.71,44.83) 68.59,44.54 ; 68.59,44.54 68.59,41.39 65.8,38.6 57.29,38.6 50.05,31.36 46.11,31.36 45.6,30.85 R16.2 ; 68.59,44.54 68.59,44.95 ; 68.59,44.54 arc(68.47,44.83) 68.18,44.95 ; 68.59,44.95 68.18,44.95 ; 68.18,44.95 R13.1
  Top Layer w0.381: v1(43.7,28.69) 45.6,28.69 R16.2
  Bottom Layer w0.254: H1.6 97.55,63.36 96.78,62.6 83.83,62.6 82.69,61.46 82.69,58.16 82.43,57.9 61.73,57.9 60.21,56.38 60.21,50.67 61.35,49.52 69.23,49.52 69.61,49.14 v1(69.61,45.97)
  Bottom Layer w0.381: v1(85.23,13.58) 76.34,13.58 73.67,10.91 46.87,10.91 42.18,15.61 42.18,27.17 v1(43.7,28.69)
IO1_R3: length 39.1
  Top Layer w0.254: FPC1.33 88.38,45.61 85.48,48.51 81.8,48.51 80.15,50.16 69.35,50.16 67.83,51.68 67.83,52.82 65.67,54.98 65.67,58.49 64.85,59.31 U2.39
IO2_R4: length 37.5
  Top Layer w0.254: U2.38 64.78,58.04 65.16,57.65 65.16,54.6 67.32,52.44 67.32,51.55 69.23,49.65 79.89,49.65 81.54,48 85.23,48 87.88,45.35 FPC1.32
IO3_VSY: length 37.6
  Top Layer w0.254: v1(47.76,41.39) U2.15 ; v1(75.7,35.55) 75.7,37.71 75.88,37.89 FPC1.8
  Bottom Layer w0.254: v1(75.7,35.55) 51.06,35.55 47.76,38.85 v1(47.76,41.39)
IO4_INT: length 46.2
  Top Layer w0.254: 28.5,39.79 28.5,34.88 28.84,34.54 44.84,34.54 v1(45.73,35.42) ; v1(47.51,56.76) 46,56.76 U2.4
  Bottom Layer w0.254: v1(45.73,35.42) 45.73,53.97 47.51,55.75 v1(47.51,56.76)
IO5_DE: length 54.7
  Top Layer w0.254: v1(48.14,55.49) 46,55.49 U2.5 ; v1(75.07,34.92) 75.07,37.97 75.38,38.27 FPC1.7
  Bottom Layer w0.254: v1(48.14,55.49) 48.14,46.73 46.87,45.46 46.87,37.97 49.92,34.92 v1(75.07,34.92)
IO6_G3: length 48.6
  Top Layer w0.254: v1(49.16,54.22) 46,54.22 U2.6 ; FPC1.25 84.38,43.77 83.45,44.7 v1(82.18,44.7)
  Bottom Layer w0.254: v1(49.16,54.22) 49.16,52.19 51.57,49.78 54.37,49.78 56.53,47.62 56.53,46.35 58.13,44.75 82.13,44.75 v1(82.18,44.7)
IO7_PCLK: length 34.8
  Top Layer w0.254: U2.7 v1(49.79,52.96) ; v1(70.75,45.33) 72.66,45.33 73.04,44.95 75.19,44.95 75.84,44.3 L1.2
  Bottom Layer w0.254: v1(70.75,45.33) 58.3,45.33 57.03,46.6 57.03,47.87 54.49,50.41 52.34,50.41 v1(49.79,52.96)
IO8_SDA: length 40.1
  Top Layer w0.254: R1.2 28.37,41.05 28,40.68 28,34.61 28.59,34.03 45.6,34.03 47.03,35.45 47.03,43.96 47.64,44.57 47.64,46.22 47.25,46.61 U2.12
IO9_SCL: length 40
  Top Layer w0.254: R4.2 26.84,41.36 27.5,40.7 27.5,34.23 28.2,33.52 48.78,33.52 50.3,35.04 50.3,36.48 50.12,36.66 49.97,36.66 49.79,36.84 49.79,38 49.97,38.18 50.12,38.18 50.3,38.36 U2.17
IO10_B7: length 34.1
  Top Layer w0.254: FPC1.13 78.38,38.86 77.99,38.47 v1(77.99,36.95) ; v1(51.57,41.39) 51.57,42.79
  Bottom Layer w0.254: v1(77.99,36.95) 53.6,36.95 51.57,38.98 v1(51.57,41.39)
IO14_B3: length 29.7
  Top Layer w0.254: v1(56.65,41.36) U2.22 ; FPC1.17 80.38,41.27 v1(80.66,41.55)
  Bottom Layer w0.254: v1(80.66,41.55) 66.59,41.55 64.15,39.11 58.05,39.11 56.65,40.5 v1(56.65,41.36)
IO17_B6: length 43.2
  Top Layer w0.254: FPC1.14 78.88,38.47 v1(78.62,38.22) ; U2.10 46,49.14 v1(50.05,49.14)
  Bottom Layer w0.254: v1(50.05,49.14) 54.11,49.14 55.89,47.36 55.89,39.87 57.54,38.22 v1(78.62,38.22)
IO18_B5: length 44.3
  Top Layer w0.254: v1(50.05,47.87) 46,47.87 U2.11 ; FPC1.15 79.35,39.79 79.35,38.5 v1(79.63,38.22)
  Bottom Layer w0.254: v1(79.63,38.22) 79,37.58 57.41,37.58 55.38,39.62 55.38,47.11 54.62,47.87 v1(50.05,47.87)
IO21_G7: length 29.9
  Top Layer w0.254: FPC1.21 82.38,41.59 v1(81.77,42.2) ; v1(57.92,41.36) U2.23
  Bottom Layer w0.254: v1(57.92,41.36) 57.92,40.76 58.94,39.74 63.89,39.74 66.34,42.2 v1(81.77,42.2)
IO38_B4: length 23.8
  Top Layer w0.254: U2.31 66.55,49.15 68.59,47.11 78.62,47.11 79.88,45.86 FPC1.16
IO39_G2: length 28.3
  Top Layer w0.254: FPC1.26 84.88,44.16 83.07,45.97 80.66,45.97 79,47.62 68.72,47.62 65.92,50.42 U2.32
IO40_R7: length 30.6
  Top Layer w0.254: FPC1.29 86.38,44.56 84.47,46.47 80.91,46.47 79.26,48.12 68.84,48.12 65.36,51.61 63.58,51.61 U2.33
IO41_R6: length 31.8
  Top Layer w0.254: FPC1.30 86.88,44.83 84.72,46.98 81.04,46.98 79.39,48.63 68.97,48.63 64.65,52.96 U2.34
IO42_R5: length 33.4
  Top Layer w0.254: FPC1.31 87.38,44.96 84.85,47.49 81.29,47.49 79.64,49.14 69.1,49.14 66.81,51.43 66.81,52.32 64.9,54.23 U2.35
IO45_G4: length 28.3
  Top Layer w0.254: v1(82.64,44.01) 82.99,44.01 83.88,43.13 FPC1.24 ; v1(61.73,41.39) U2.26
  Bottom Layer w0.254: v1(61.73,41.39) 63.38,41.39 66,44.01 v1(82.64,44.01)
IO46_HSY: length 35.5
  Top Layer w0.254: FPC1.9 76.38,36.35 v1(76.34,36.31) ; v1(49.03,41.39) U2.16
  Bottom Layer w0.254: v1(76.34,36.31) 52.08,36.31 49.03,39.36 v1(49.03,41.39)
IO47_G6: length 29.7
  Top Layer w0.254: v1(82.44,42.8) 82.88,42.37 FPC1.22 ; v1(59.19,41.36) 59.19,42.79
  Bottom Layer w0.254: v1(59.19,41.36) 59.19,40.76 59.7,40.25 63.64,40.25 66.19,42.8 v1(82.44,42.8)
IO48_G5: length 29.1
  Top Layer w0.254: v1(81.99,43.43) 82.69,43.43 83.38,42.74 FPC1.23 ; v1(60.46,41.39) U2.25
  Bottom Layer w0.254: v1(81.99,43.43) 66.05,43.43 63.38,40.76 60.72,40.76 60.46,41.01 v1(60.46,41.39)
LCD_RST/NC: length 4.3
  Top Layer w0.254: R3.2 72.78,41.14 73.04,40.89 74.69,40.89 74.88,40.7 FPC1.6
PCLK: length 4.3
  Top Layer w0.254: 77.62,42.26 L1.1 ; 77.62,42.26 C6.2 ; 77.62,42.26 77.61,42.25 77.61,41.39 77.38,41.16 FPC1.11
R: length 4.2
  Top Layer w0.254: 101.2,14.1 101.2,12.32 100.47,12.32 100.13,11.97 U6.3
R1IN: length 50
  Top Layer w0.254: USB3.3 102.91,35.07 102.14,34.3 98.29,34.3 95.39,37.2 95.39,41.01 94.5,41.9 90.31,41.9 89.28,42.93 89.28,46.1 85.86,49.52 82.31,49.52 81.67,50.16 81.67,57.9 80.71,58.87 76.1,58.87 75.68,58.45 75.68,57.76 75.25,57.32 U7.13
R2OUT: length 2.7
  Top Layer w0.254: U7.9 70.17,54.78 69.99,54.6 69.99,53.93 R34.2
RTS: length 7.5
  Top Layer w0.254: 91.16,11.55 R29.2 ; 91.16,11.55 91.71,11.55 92.13,11.97 U6.14 ; 91.16,11.55 91.25,11.46 91.25,10.84 90.94,10.53 88.91,10.53 88.38,10 Q3.2
RXD0: length 144.9
  Top Layer w0.254: D11.1 104.11,9.48 103.25,8.62 R21.1 103.25,7.11 102.74,6.6 85.17,6.6 83.23,8.53 83.23,29.2 v1(83.42,29.39) ; U2.36 62.11,55.5 v1(62.02,55.59) 61.57,56.03 61.12,56.03 60.7,56.45 60.7,61.64 61.44,62.37 67.22,62.37 69.2,64.36 69.2,66.58 70.07,67.45 90.22,67.45 91.1,66.58 91.1,66.56 92.47,65.18 H1.4 ; R34.1 70.62,51.79 70.62,51.17 v1(70.5,51.05)
  Bottom Layer w0.254: v1(83.42,29.39) 83.24,29.57 83.24,36.8 84.62,38.18 84.62,50.83 84,51.45 71.68,51.45 71.5,51.63 71.02,51.63 70.67,51.29 70.67,51.22 v1(70.5,51.05) 70.5,50.92 69.89,50.31 62.09,50.31 61.12,51.27 61.12,52.22 61.3,52.4 61.68,52.4 61.86,52.58 61.86,53.75 61.68,53.93 61.3,53.93 61.12,54.11 61.12,55.26 61.45,55.59 v1(62.02,55.59)
SD_CD: length 2.5
  Top Layer w0.254: U1.9 22.31,29.05 R11.1
SD_CS: length 2.5
  Top Layer w0.254: R8.1 22.36,21.35 U1.2
SD_MISO: length 56.4
  Top Layer w0.254: R10.1 22.31,26.85 U1.7 17.35,26.85 16.65,27.55 16.65,31.23 17.28,31.87 49.79,31.87 55.38,37.46 U2.21
SD_MOSI: length 60.4
  Top Layer w0.254: R9.1 21.65,22.9 21.2,22.45 U1.3 17.69,22.45 15.63,24.5 15.63,31.74 16.78,32.89 49.03,32.89 52.84,36.69 U2.19
SD_SCLK: length 56.2
  Top Layer w0.254: U2.20 54.11,37.08 49.41,32.38 17.03,32.38 16.14,31.49 16.14,25.39 16.88,24.65 U1.5
SIQ-A: length 35.3
  Top Layer w0.254: R35.2 37.54,61.39 C27.1 ; SW2.A 29.73,56.73 29.73,51.94 32.02,49.65 39.38,49.65 41.42,51.69 U2.8
  Top Layer w0.381: 37.41,61.18 37.26,61.33 32.4,61.33 31.75,60.69 SW2.A
SIQ-B: length 36.7
  Top Layer w0.254: U2.9 41.04,50.42 39.76,49.14 31.34,49.14 28.84,51.64 28.84,56.89 26.98,58.75 SW2.B ; C28.1 20.93,63.06 R36.2
  Top Layer w0.381: 20.96,61.46 26.17,61.46 26.75,60.88 SW2.B
SIQ-S: length 51.6
  Top Layer w0.254: 31.75,54.71 36.95,54.71 37.98,55.75 v1(37.98,58.16) ; 31.75,54.71 SW2.D ; 31.75,54.71 31.75,53.61 R37.2 ; v1(68.84,46.47) R12.1
  Bottom Layer w0.254: v1(68.84,46.47) 68.84,46.22 68.59,45.97 58.27,45.97 57.54,46.7 57.54,48.12 54.62,51.05 52.59,51.05 50.68,52.95 50.68,54.98 48.14,57.52 46.71,57.52 46.08,58.16 v1(37.98,58.16)
SL_D+: length 20.9
  Top Layer w0.254: U6.5 97.76,14.51 96.91,15.36 96.91,19.17 97.8,20.06 105.68,20.06 105.93,19.8 USB1.A7 107.24,19.8 108.6,19.8 108.85,19.55 108.85,19.05 108.6,18.8 USB1.B7
SL_D-: length 17.7
  Top Layer w0.254: USB1.A6 105.16,19.3 104.91,19.55 98.06,19.55 97.42,18.92 97.42,16.38 98.01,15.78 U6.6 ; USB1.B6 106.19,20.3 v1(105.8,20.69)
  Bottom Layer w0.254: v1(105.04,19.42) 105.04,19.93 v1(105.8,20.69)
T: length 2.2
  Top Layer w0.254: U6.2 99.79,10.7 100.47,10.03 D11.2
T1OUT: length 50.1
  Top Layer w0.254: U7.14 76.52,57.45 76.09,57.88 76.09,58.28 76.27,58.46 80.54,58.46 81.27,57.74 81.27,54.59 81.09,54.41 80.84,54.41 80.66,54.23 80.66,53.06 80.84,52.88 81.09,52.88 81.27,52.7 81.27,49.99 82.14,49.12 85.69,49.12 88.88,45.93 88.88,42.83 90.19,41.52 94.38,41.52 95.01,40.89 95.01,37.08 98.21,33.87 102.15,33.87 102.95,33.07 USB3.2
T2IN: length 4.2
  Top Layer w0.254: R32.2 R33.2 71.64,53.93 71.64,54.86 71.44,55.05 U7.10
TXD0: length 149.2
  Top Layer w0.254: v1(82.63,29.39) 82.82,29.2 82.82,8.37 85,6.19 103.77,6.19 104.9,7.32 104.9,11.17 103.98,12.08 D10.2 ; v1(71.26,51.05) 71.13,51.17 71.13,51.86 R33.1 ; U2.37 62.25,56.77 62.12,56.89 v1(61.99,56.89) 61.54,56.44 61.28,56.44 61.11,56.62 61.11,61.47 61.61,61.97 67.39,61.97 69.61,64.19 69.61,66.41 70.24,67.05 80.87,67.05 81.05,66.87 81.05,65.96 81.23,65.78 82.39,65.78 82.57,65.96 82.57,66.87 82.75,67.05 90.05,67.05 90.69,66.41 90.69,65.95 89.93,65.18 H1.3
  Bottom Layer w0.254: v1(61.99,56.89) 60.72,55.62 60.72,51.05 61.86,49.9 70.18,49.9 71.26,50.98 v1(71.26,51.05) 83.83,51.05 84.21,50.67 84.21,38.35 82.84,36.97 82.84,29.59 v1(82.63,29.39)
USB_D+: length 29.8
  Top Layer w0.254: U2.14 45.22,44.07 44.61,44.67 43.97,44.67 40.41,48.23 26.72,48.23 24.93,46.43 24.93,43.89 24.08,43.05 23.38,43.05 22.65,42.32 D8.4
USB_D-: length 29.7
  Top Layer w0.254: U2.13 44.99,45.34 44.74,45.08 44.14,45.08 40.58,48.63 26.55,48.63 24.52,46.6 24.52,44.06 23.91,43.45 23.35,43.45 22.59,44.22 D8.6
VLED+: length 46.7
  Top Layer w0.254: 90.94,38.09 91.38,38.53 FPC1.39
  Top Layer w0.508: U4.3 55.43,30.97 R15.2 55.4,33.28 57.41,35.3 64.02,35.3 67.96,31.36 84.21,31.36 90.94,38.09
VLED-: length 50.2
  Top Layer w0.254: FPC1.40 91.88,37.88
  Top Layer w0.508: L2.2 64.54,17.41 67.57,20.44 67.57,29.46 68.59,30.47 84.47,30.47 91.88,37.88
$1N113: length 5.6
  Top Layer w0.254: U2.27 64.65,44.07 65.29,43.43 R7.2 R13.2 R12.2
$1N130: length 1.8
  Top Layer w0.254: R27.1 93.15,48.67 94.88,48.67
$1N134: length 1.9
  Top Layer w0.254: R23.1 111,46.35
$1N136: length 1.8
  Top Layer w0.254: D5.1 97.41,60.32 R22.1
$1N138: length 4.2
  Top Layer w0.254: C16.1 100.21,15 100.21,13.71 99.75,13.24 U6.4
$1N150: length 2.4
  Top Layer w0.254: Q2.1 88.13,11.4 88.29,11.57 R29.1
$1N151: length 9.6
  Top Layer w0.254: v1(88.53,8.12) 87.31,8.12 Q3.1 ; R30.1 89.68,14.72 v1(89.67,14.72)
  Bottom Layer w0.254: v1(89.67,14.72) 89.67,9.26 v1(88.53,8.12)
$1N159: length 1.7
  Top Layer w0.254: D7.1 R31.2
$1N165: length 2.3
  Top Layer w0.254: C22.1 72.71,64.23 U7.6
$1N168: length 2.5
  Top Layer w0.254: U7.2 77.79,63.06 77.19,63.65 C18.2
$1N169: length 2.5
  Top Layer w0.254: U7.4 75.25,63.06 74.81,63.49 74.81,64.23 C21.2
$1N170: length 4.6
  Top Layer w0.254: C21.1 74.06,65.66 73.8,65.4 73.8,63.49 73.98,63.31 U7.5
$1N171: length 2.3
  Top Layer w0.254: U7.1 79.06,64.16 C19.2
$1N172: length 11.5
  Top Layer w0.254: U7.3 76.52,60.52 76.72,60.32 80.02,60.32 80.28,60.57 80.28,65.4 80.01,65.66 C19.1
$1N204: length 5.5
  Top Layer w0.381: Q1.3 48.48,29.28 U4.4
  Top Layer w0.508: U4.4 51.85,29.47 R14.2
$1N207: length 1.8
  Top Layer w0.254: Q1.1 45.64,27.14 R16.1

## Copper pours and planes (outline as drawn; the poured copper is in the pictures)
5V_SHAOLU on Top Layer: 86.5,61.08 96.53,61.08 96.53,47.62 86.5,47.62
24V_D1 on Top Layer: 54.49,31.66 63.64,31.66 63.64,22.1 54.49,22.1
24V_D1 on Top Layer: 98.31,53.97 110.37,53.97 110.37,45.58 98.31,45.58
24V_D1 on Bottom Layer: 58.18,50.67 106.06,50.67 106.06,23.11 58.18,23.11
GND on Top Layer: -6.21,78.86 123.84,78.86 123.84,-7.75 -6.21,-7.75
GND on Bottom Layer: -15.74,81.65 135.01,81.65 135.01,-12.33 -15.74,-12.33
VIN24V on Top Layer: 100.72,45.73 106.03,45.73 106.03,36.69 100.72,36.69
SW on Top Layer: 49.41,26.66 53.1,26.66 53.1,15.99 49.41,15.99
$1N129 on Top Layer: 97.04,55.91 105.17,55.91 105.17,47.62 97.04,47.62

## Text on the board
Top Silkscreen Layer: 包裹款-触摸屏-V1.3@20260604 | 5V | GND | TX | RX | RST | IO0
